# Altium schematic sheet BSPDTester.SchDoc
size 431 x 279 mm; SheetNumber: 1; SheetTotal: 1
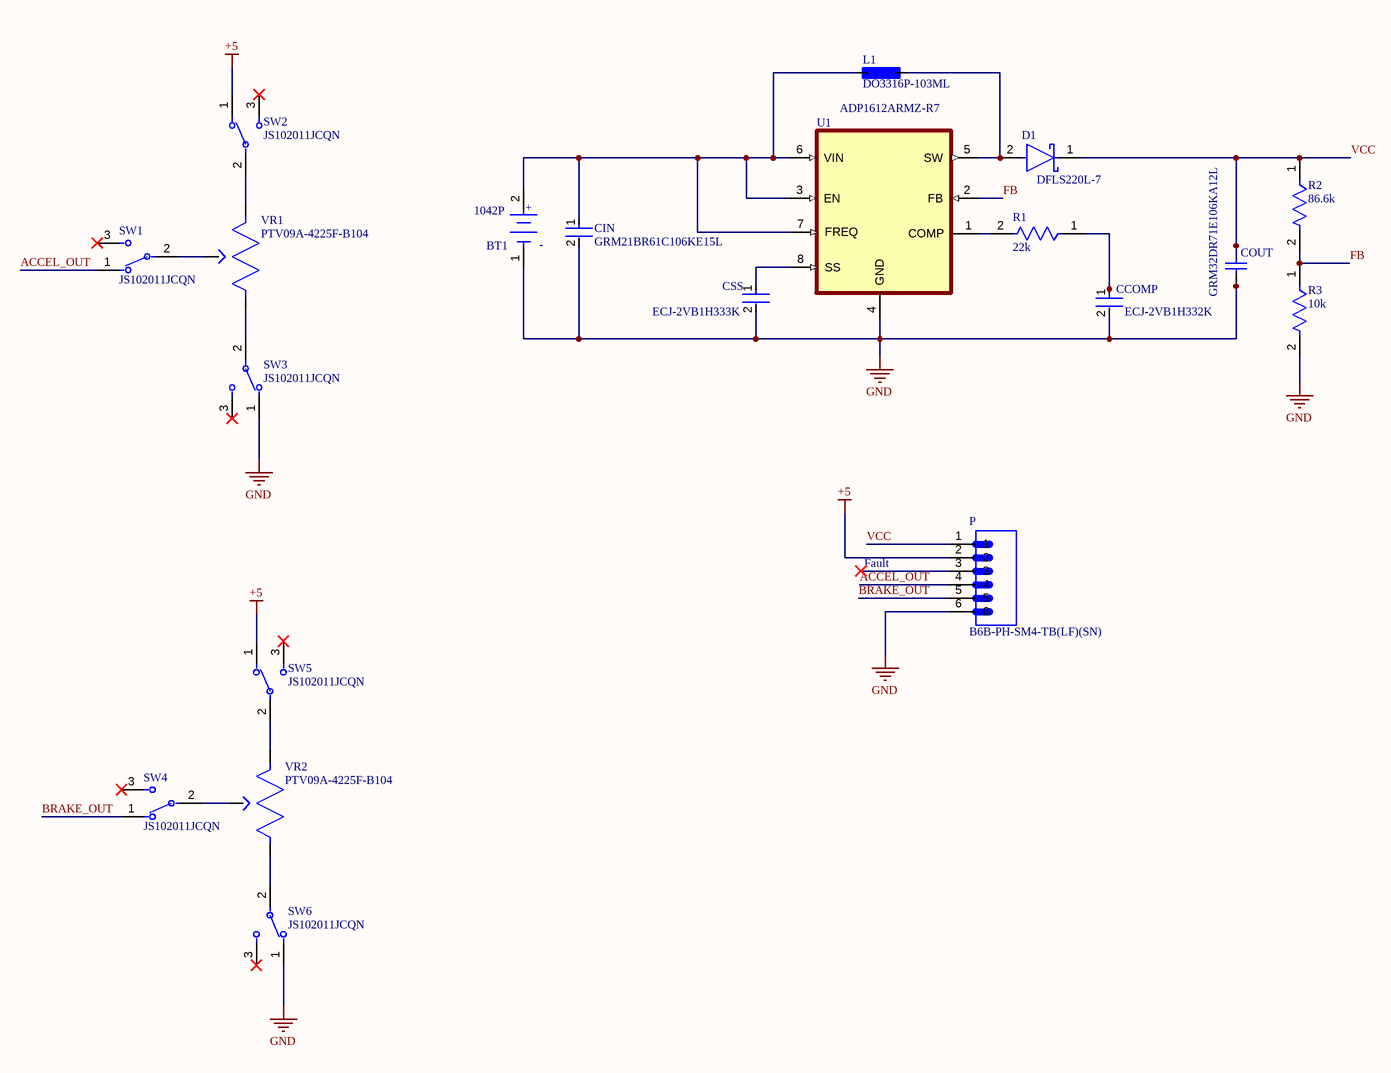
[diagram p0: BSPDTester.SchDoc]

## Parts
BT1  1042P  [FP-1042P-MFG]
CCOMP  ECJ-2VB1H332K  [FP-C0805C-DG-MFG]
CIN  GRM21BR61C106KE15L  [FP-GRM21B-0_1-IPC_C]
COUT  GRM32DR71E106KA12L  [CAPC3225X220X30LL30]
CSS  ECJ-2VB1H333K  [FP-C0805C-DG-MFG]
D1  DFLS220L-7  [FP-PowerDI123-MFG]
L1  DO3316P-103ML  [DO3316P]
P  B6B-PH-SM4-TB(LF)(SN)  [JST_B6B-PH-SM4-TB(LF)(SN)]
R1  22k  [FP-CRCW1206-e3-IPC_A]
R2  86.6k  [FP-CRCW1206-e3-IPC_A]
R3  10k  [FP-CRCW1206-e3-IPC_A]
SW1  JS102011JCQN  [FP-JS102011JCQN-MFG]
SW2  JS102011JCQN  [FP-JS102011JCQN-MFG]
SW3  JS102011JCQN  [FP-JS102011JCQN-MFG]
SW4  JS102011JCQN  [FP-JS102011JCQN-MFG]
SW5  JS102011JCQN  [FP-JS102011JCQN-MFG]
SW6  JS102011JCQN  [FP-JS102011JCQN-MFG]
U1  ADP1612ARMZ-R7  [SOIC-08]
VR1  PTV09A-4225F-B104  [PTV09]
VR2  PTV09A-4225F-B104  [PTV09]

## Nets
+5: P.2 SW2.1 SW5.1
GND: BT1.1(C) CCOMP.2 CIN.2 COUT.1 CSS.2 P.6 R3.2 SW3.1 SW6.1 U1.4(GND)
ACCEL_OUT: P.4 SW1.1
BRAKE_OUT: P.5 SW4.1
FB: R2.2 R3.1 U1.2(FB)
VCC: COUT.2 D1.1(C) P.1 R2.1
NetBT1_2: BT1.2(A) CIN.1 L1.1 U1.3(EN) U1.6(VIN) U1.7(FREQ)
NetCCOMP_1: CCOMP.1 R1.1
NetCSS_1: CSS.1 U1.8(SS)
NetD1_2: D1.2(A) L1.2 U1.5(SW)
NetR1_2: R1.2 U1.1(COMP)
NetSW1_2: SW1.2 VR1.2
NetSW2_2: SW2.2 VR1.1
NetSW3_2: SW3.2 VR1.3
NetSW4_2: SW4.2 VR2.2
NetSW5_2: SW5.2 VR2.1
NetSW6_2: SW6.2 VR2.3

Not connected (* = marked no-connect by the designer): P 3*; SW1 3*; SW2 3*; SW3 3*; SW4 3*; SW5 3*; SW6 3*

## Notes on the sheet
- Fault
- DWG. NO.
- REV.
- SHT.
- THIS DOCUMENT AND THE DATA DISCLOSED HEREIN OR HEREWITH IS THE PROPERTY OF ALTIUM LIMITED AND MAY BE FREELY DISTRIBUTED IN WHOLE. NO RIGHTS ARE RESERVED OR EXPRESS OR IMPLIED WARANTEE GIVEN.
- REVISION
- DESCRIPTION
- DATE
- APPROVED
- ENG:
- APPROVALS
- PROJECT
- DSN:
- CHK:
- REFERENCE DOCUMENTS
- PROJECT REVISION:
- TITLE
- DOCUMENT REVISION:
- DESIGN ITEM:
- BOM:
- FAB DWG:
- PCB DWG:
- ASSY DWG:
- SCALE:
- SIZE
- B
- CAGE CODE
- FILE NAME
- DWG NO.
- SHEET
- OF
- REV
- (in symbol CMP-19636-000019-1) +; -

## Library data of the parts
BT1 = CMP-19636-000019-1: BATTERY HOLDER 18650 SMD TAB; Number of Cells: 1; Max Operating Temperature: 145°C; Termination: SMD/SMT; Mount: Surface Mount; Min Operating Temperature: -50°C; Package Quantity: 200; Packaging: Tray; Lead Free: Lead Free
CCOMP CSS = CMP-2007-03243-2: CAP CER 10UF 10V X5R 0805; Manufacturer Part Number: C0805C106K8PACTU; Manufacturer: Kemet; 3DS Part Number: 220-00001; Tolerance: 10%; Temperature Coefficient: 15%; Device Class L2: Capacitors; Device Class L1: Passive Components; ComponentLink2URL: https://content.kemet.com/datasheets/KEM_C1006_X5R_SMD.pdf; Height: 1.4mm; Lead Free: Yes; Digikey Description: CAP CER 10UF 10V X5R 0805; Octopart: https://octopart.com/c0805c106k8pactu-kemet-98697; Capacitance: 10uF; Value: 10uF; Temperature Range Low: -55°C; Temperature: -55°C to +85°C; Automotive: No; Mouser Description: CAP CER 10UF 10V X5R 0805; Ipc Land Pattern Name: CAPC200125X125; Material: Ceramic; Temperature Range High: +85°C; Voltage: 10V; RoHS: TRUE; Device Class L3: Ceramic Capacitors; ComponentLink2Description: Datasheet; Voltage Rating: 10V; Package: C0805C-DG; Temperature Characteristic: X5R; Category: Cap
CIN = CMP-2007-03453-2: Chip Multilayer Ceramic Capacitors for General Purpose, 0805, 10uF, X5R, 15%, 10%, 16V; Radiation Hardening: No; Thickness: 0.053inch; Voltage Rating (DC): 16V; Lead Free: Lead Free; Package Quantity: 1; Width: 1.25mm; Case Code (Imperial): 0805; Depth: 1.25mm; Packaging: Tape and Reel; Dielectric: X5R; Max Operating Temperature: 85°C; Tolerance: 10%; Voltage Rating: 16V; Voltage: 16V; Capacitance: 10uF; Height: 1.25mm; Case Code (Metric): 2012; Material: Ceramic; Mount: Surface Mount; Case/Package: 0805; REACH SVHC: No SVHC; Length: 2mm; Min Operating Temperature: -55°C; Termination: SMD/SMT
COUT = CMP-2000-06359-1: Chip Capacitor, 10 uF, +/- 10%, 25 V, -55 to 125 degC, 1210 (3225 Metric), RoHS, Tape and Reel; Manufacturer: Murata; Construction form: 1210; Ceramic type: X7R; Capacitance: 10µF; Rated voltage: 25VDC; Package Reference: 1210; Datasheet Version: 03/2016; Package Description: 2-Pin Surface Mount Device, Body 3.2 x 2.5 mm; Mounting Technology: SurfaceMount; Manufacturer URL: http://www.murata.com/; Capacitance tolerance: ±10%; Datasheet URL: http://search.murata.co.jp/Ceramy/image/img/A01X/G101/ENG/GRM32DR71E106KA12-01.pdf
D1 = CMP-12790-000030-1: DIODE SCHOTTKY 20V 2A POWERDI123; Manufacturer: Diodes Inc.; Capacitance: 75pF; Max Junction Temp: +125°C; Max Surge Forward Current: 40A; Peak Reverse Current: 1mA; Value: 75pF; Package: PowerDI123; Temperature: -55°C to +125°C; ComponentLink2Description: Datasheet; RoHS: TRUE; Category: Diode; Digikey Description: DIODE SCHOTTKY 20V 2A POWERDI123; Temperature Range Low: -55°C; Mouser Description: DFLS220L Series 20 V 2 A Surface Mount Schottky Barrier Rectifier - PowerDI-123; Device Class L3: Schottky Diodes; Device Class L2: Diodes; Device Class L1: Discrete Semiconductors; Manufacturer Part Number: DFLS220L-7; Reverse Voltage: 20V; Max Repetitive Reverse Voltage: 20V; Octopart: https://octopart.com/dfls220l-7-diodes+inc.-328575; Temperature Range High: +125°C; Automotive: No; Forward Current: 2A; Footprint Url: https://www.diodes.com/assets/Package-Files/PowerDI123.pdf; Lead Free: Yes; ComponentLink2URL: https://www.diodes.com/assets/Datasheets/ds30517.pdf; Height: 1mm
L1 = DO3316P: <b>COILCRAFT</b>; Price: None; MP: DO3316P; Value: *; Package: None; SnapEDA_Link: https://www.snapeda.com/parts/DO3316P/Coilcraft/view-part/561901/?ref=snap; Availability: Unavailable; MF: Coilcraft
P = B6B-PH-SM4-TB(LF)(SN): Connector Header Surface Mount 6 position 0.079 _2.00mm_; MF: JST Sales; MP: B6B-PH-SM4-TB_LF__SN_; Value: *; Price: None; Package: None; SnapEDA_Link: https://www.snapeda.com/parts/B6B-PH-SM4-TB%28LF%29%28SN%29/JST%20Sales%20America%20Inc./view-part/52131/?ref=snap; Availability: Unavailable
R1-R3 = CMP-2003-01962-2: RES Thick Film, 22kΩ, 1%, 0.25W, 100ppm/°C, 1206; Voltage Rating (DC): 200V; Resistance: 22kR; Max Power Dissipation: 250mW; Lead Free: Lead Free; Length: 3.2mm; Case Code (Imperial): 1206; Max Operating Temperature: 155°C; Packaging: Tape and Reel; Composition: Thick Film; Temperature Coefficient: 100ppm/°C; Contact Plating: Tin; Number of Terminations: 2; Case Code (Metric): 3216; Tolerance: 1%; Weight: 0.000353oz; Features: Automotive AEC-Q200; Min Operating Temperature: -55°C; Width: 0.063inch; Package Quantity: 10; Case/Package: 1206; Termination: SMD/SMT; Military Standard: Not; Depth: 1.6mm; Voltage Rating: 200V; Radiation Hardening: No; Power Rating: 250mW; Height: 0.55mm
SW1-SW6 = CMP-10038-000010-1: SWITCH SLIDE SPDT 300MA 6V; Electrical Life: 5000Cycles; Switch Function: On-On; Actuator Material: Nylon; Actuator Length: 2mm; Actuator Type: Standard; Current Rating: 300mA; Voltage Rating (DC): 6V; Min Operating Temperature: -40°C; Throw Configuration: SPDT; Mount: Surface Mount; Switch Travel: 2mm; Max Operating Temperature: 85°C; Packaging: Cut Tape; Contact Plating: Silver; Contact Material: Copper Alloy
U1 = ADP1612ARMZ-R7: Boost, SEPIC Switching Regulator IC Positive 1 Output 1.4A (Switch) 8-TSSOP, 8-MSOP (0.118, 3.00mm Width); MF: Analog Devices; Price: None; Value: *; Availability: Good; Check_prices: https://www.snapeda.com/parts/ADP1612ARMZ-R7/Analog%20Devices%20Inc./view-part/42012/?ref=eda; SnapEDA_Link: https://www.snapeda.com/parts/ADP1612ARMZ-R7/Analog%20Devices%20Inc./view-part/42012/?ref=snap; Purchase-URL: https://pricing.snapeda.com/search/part/ADP1612ARMZ-R7/?ref=eda; MP: ADP1612ARMZ-R7; Package: MSOP-8 Analog Devices
VR1 VR2 = PTV09A-4225F-B104: 100k Ohm 1 Gang Linear Through Hole, Snap In Potentiometer Detent 1 Kierros Carbon 0.05W, 1/20W PC Pins, Board Locks; MF: Bourns; Value: *; MP: PTV09A-4225F-B104; Package: None; Price: None; Availability: Unavailable; SnapEDA_Link: https://www.snapeda.com/parts/PTV09A-4225F-B104/Bourns/view-part/1448300/?ref=snap